# Altium schematic sheet TopLevel.SchDoc
size A4
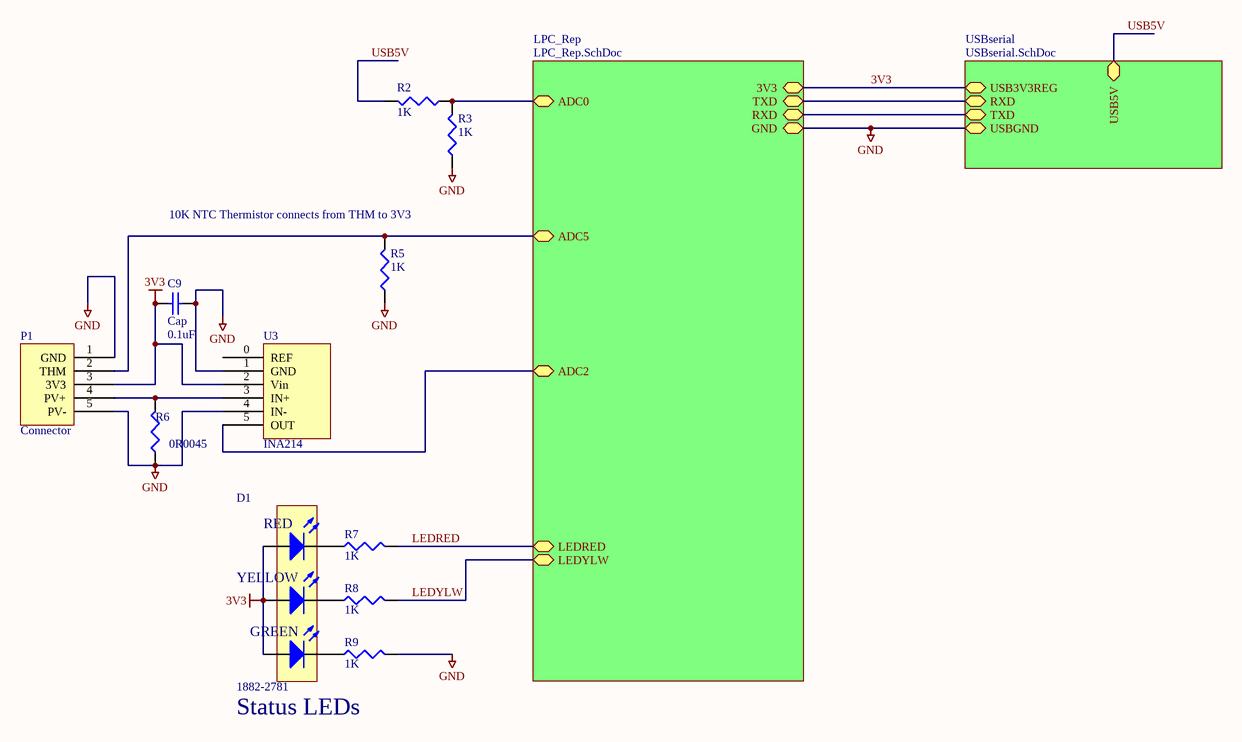
[diagram p0: TopLevel.SchDoc]

## Parts
C9  Cap  value 0.1uF  [0603]
D1  1882-2781  [LED_TRILEVEL]
P1  Connector  [TermBlock5]
R2  1K  [0603]
R3  1K  [0603]
R5  1K  [0603]
R6  0R0045  [1206]
R7  1K  [0603]
R8  1K  [0603]
R9  1K  [0603]
U3  INA214  [SOP6 - INA214]

## Sub-sheets
LPC_Rep = LPC_Rep.SchDoc: ADC0, ADC5, TXD, RXD, LEDRED, LEDYLW, ADC2, 3V3, GND
USBserial = USBserial.SchDoc: RXD, TXD, USB3V3REG, USBGND, USB5V

## Nets
3V3: C9.1 D1.4(A) D1.5(A) D1.6(A) P1.3(3V3) U3.2(Vin) ; sheet LPC_Rep/3V3, sheet USBserial/USB3V3REG
GND: C9.2 P1.1(GND) P1.5(PV-) R3.1 R5.1 R6.1 R9.2 U3.1(GND) U3.4(IN-) ; sheet LPC_Rep/GND, sheet USBserial/USBGND
LEDRED: R7.2 ; sheet LPC_Rep/LEDRED
LEDYLW: R8.2 ; sheet LPC_Rep/LEDYLW
USB5V: R2.2 ; sheet USBserial/USB5V
NetD1_1: D1.1(K) R9.1
NetD1_2: D1.2(K) R8.1
NetD1_3: D1.3(K) R7.1
NetP1_2: P1.2(THM) R5.2 ; sheet LPC_Rep/ADC5
NetP1_4: P1.4(PV+) R6.2 U3.3(IN+)
NetR2_1: R2.1 R3.2 ; sheet LPC_Rep/ADC0
NetU3_5: U3.5(OUT) ; sheet LPC_Rep/ADC2
(unnamed): sheet LPC_Rep/TXD, sheet USBserial/RXD
(unnamed): sheet LPC_Rep/RXD, sheet USBserial/TXD

Not connected (* = marked no-connect by the designer): U3 0(REF)

## Notes on the sheet
- (near R5) 10K NTC Thermistor connects from THM to 3V3
- Status LEDs
- (in symbol LED-TRILEVEL) RED; YELLOW; GREEN

## Library data of the parts
C9 = Cap: Capacitor; Published: 8-Jun-2000; LatestRevisionDate: 17-Jul-2002; LatestRevisionNote: Re-released for DXP Platform.; PackageReference: RAD-0.3; Publisher: Altium Limited; PackageDescription: Radial Cap, Thru-Hole; 2 Leads; 0.3 in Pin Spacing
D1 = LED-TRILEVEL: Three level LED; Farnell: 1461596
P1 = CONN
R2 R3 R5-R9 = RES1: Resistor; Order#: 9331697; Supplier: Farnell; Price: 0.05